# Altium schematic sheet 01_Main.SchDoc: =GlobalProjectName
size 594 x 420 mm; CheckedBy: A_D; Author: A_D; SheetNumber: 1; SheetTotal: 4; PageSetup: Record=PageOptions|CenterHorizontal=True|CenterVertical=True|PrintScale=0.70|XCorrection=1.00|YCorrection=1.00|PrintKind=2|BorderSize=5000000|LeftOffset=9000|BottomOffset=10100|Orientation=2|PaperLength=11176|PaperWidth=8636|Scale=100|PaperSource=259|PrintQuality=-3|MediaType=1|DitherType=10|PrintScaleMode=1|PaperKind=A3|PaperIndex=8
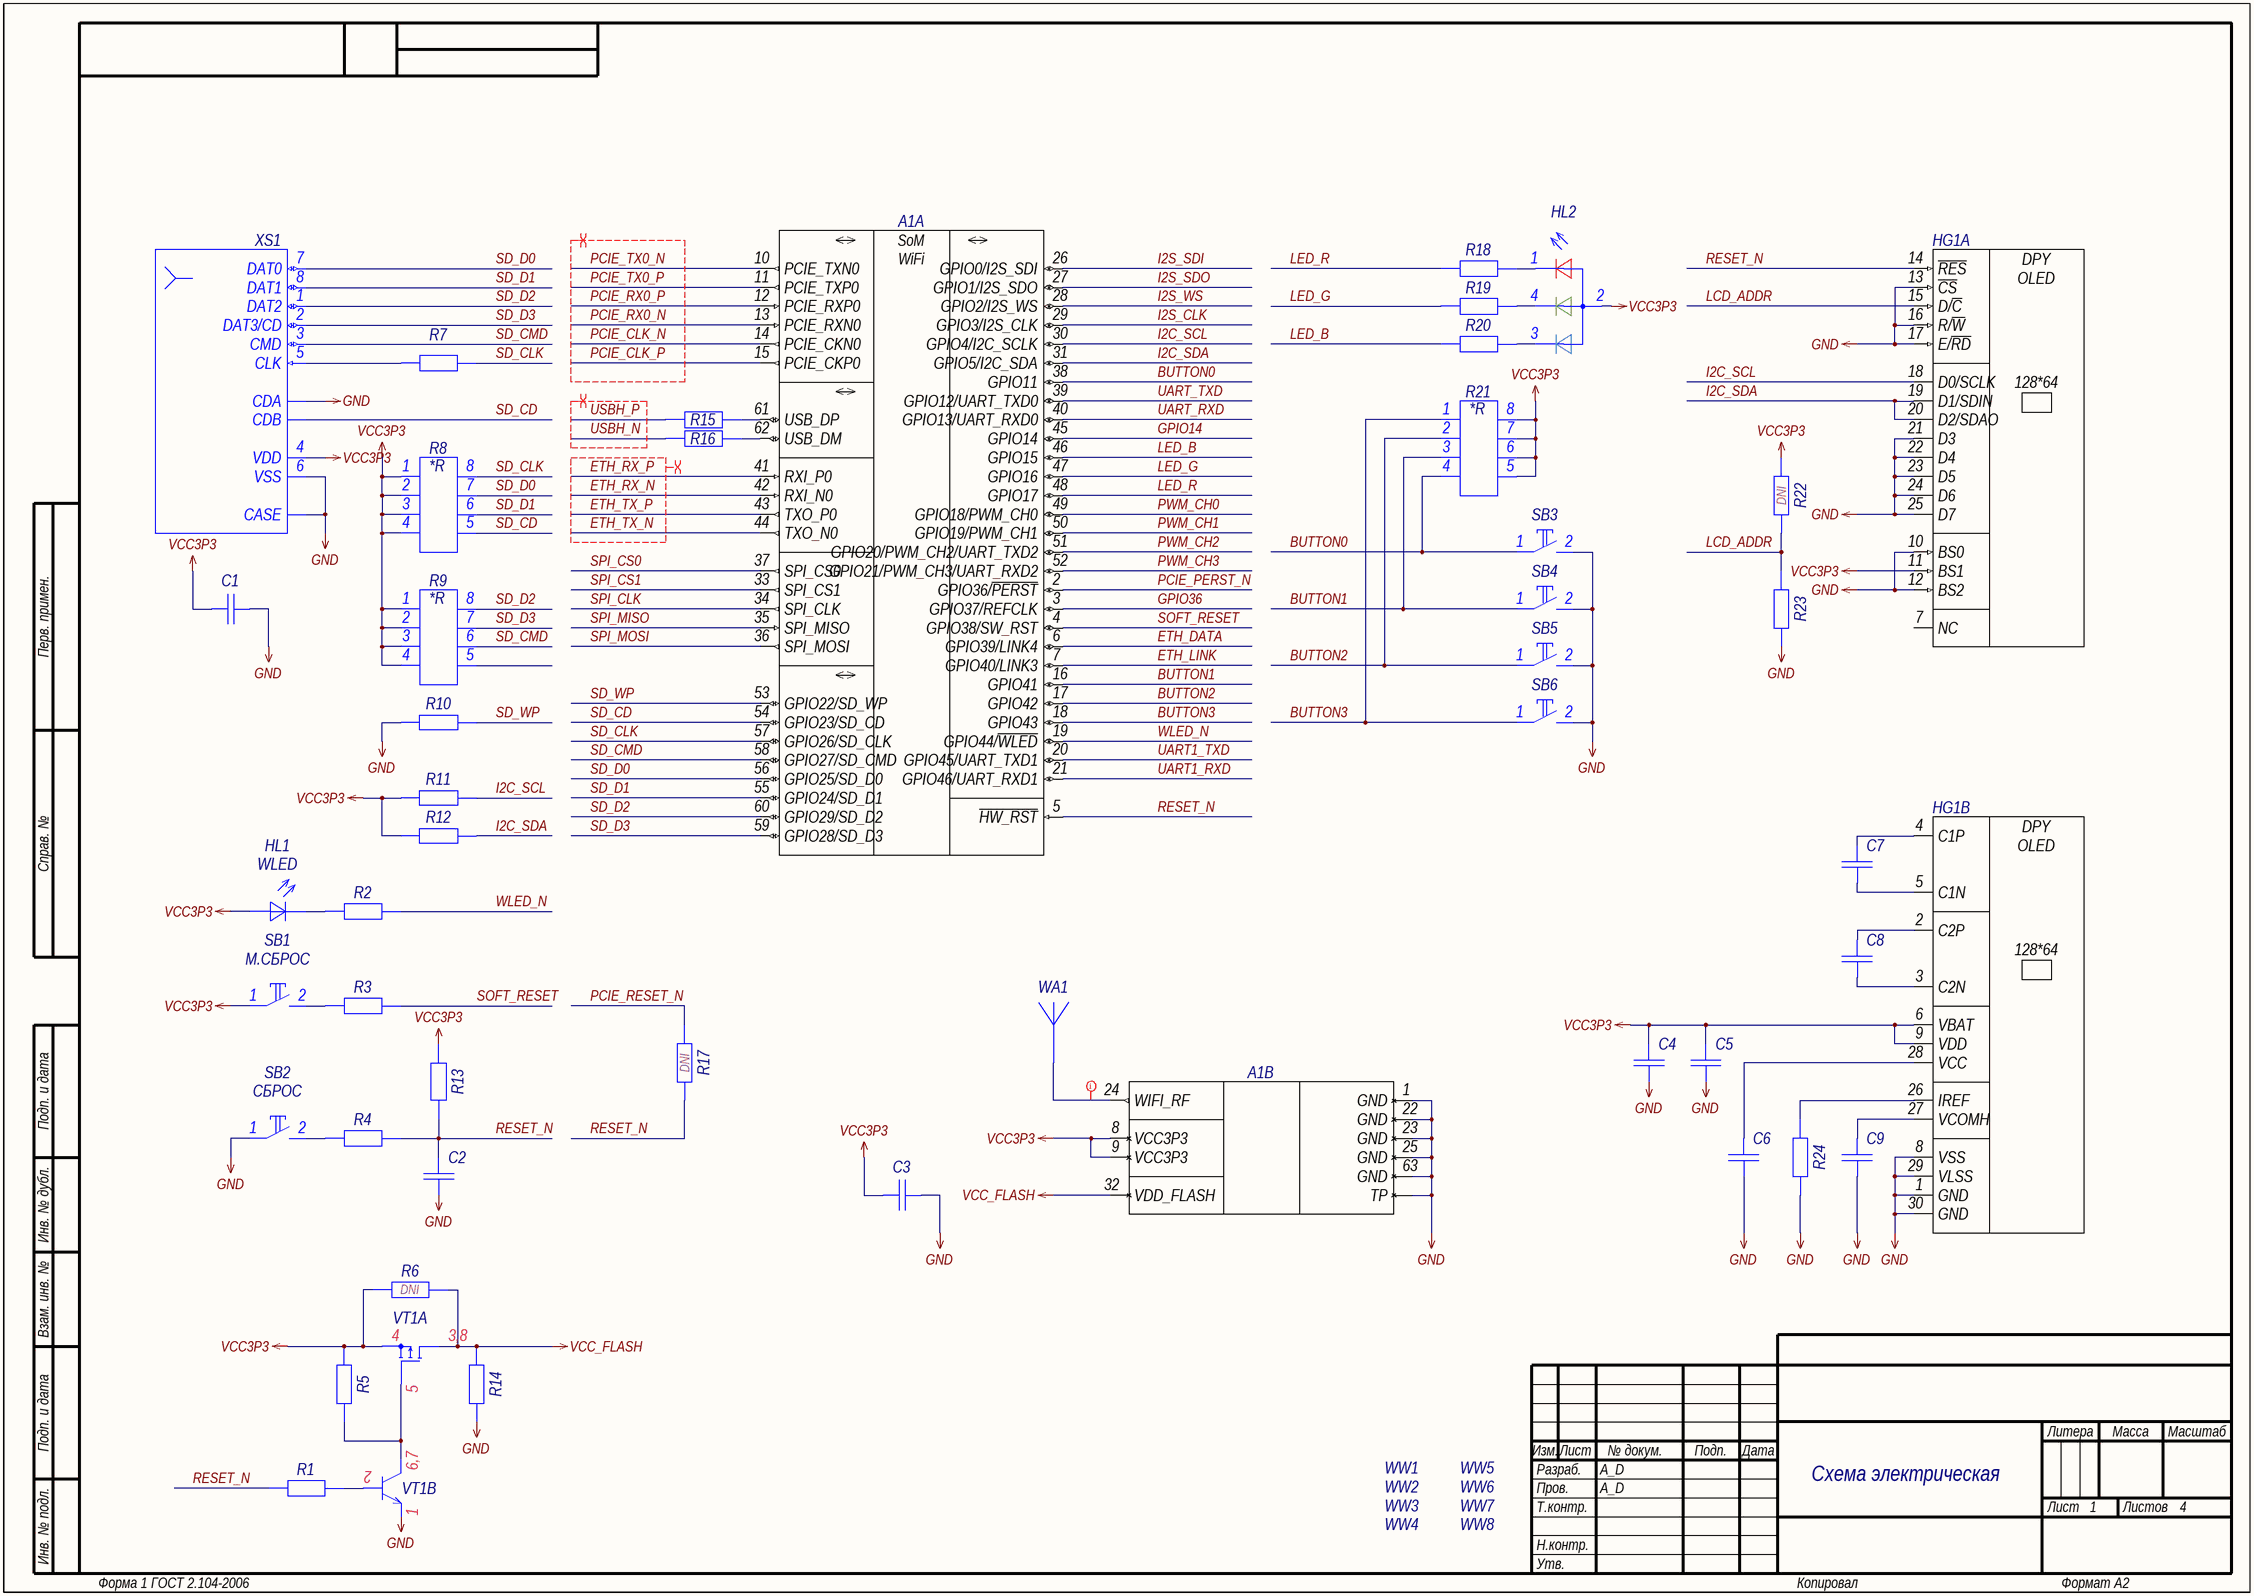
[diagram p0: 01_Main.SchDoc]

## Parts
A1  OM-O2Sx  [OM-O2Sx]  (value not drawn)  (parts A,B of 2)
C1  Capacitor  [C0603_L]  (value not drawn)
C2  Capacitor  [C0603_L]  (value not drawn)
C3  Capacitor  [C0603_L]  (value not drawn)
C4  Capacitor  [C0603_L]  (value not drawn)
C5  Capacitor  [C0603_L]  (value not drawn)
C6  Capacitor  [C0603_L]  (value not drawn)
C7  Capacitor  [C0603_L]  (value not drawn)
C8  Capacitor  [C0603_L]  (value not drawn)
C9  Capacitor  [C0603_L]  (value not drawn)
HG1  UG-2864HSWEG01  [UG-2864HSWEG01]  (value not drawn)  (parts A,B of 2)
HL1  WLED  [LD0603_L]
HL2  USER LED  [FM-B1515RGBA-HG]  (value not drawn)
R1  Resistor  [R0603_L]  (value not drawn)
R2  Resistor  [R0603_L]  (value not drawn)
R3  Resistor  [R0603_L]  (value not drawn)
R4  Resistor  [R0603_L]  (value not drawn)
R5  Resistor  [R0603_L]  (value not drawn)
R6  Resistor  [R0603_L]  (value not drawn)  (no BOM)
R7  Resistor  [R0603_L]  (value not drawn)
R8  Resistor-4  [CAT16-x4]  (value not drawn)
R9  Resistor-4  [CAT16-x4]  (value not drawn)
R10  Resistor  [R0603_L]  (value not drawn)
R11  Resistor  [R0603_L]  (value not drawn)
R12  Resistor  [R0603_L]  (value not drawn)
R13  Resistor  [R0603_L]  (value not drawn)
R14  Resistor  [R0603_L]  (value not drawn)
R15  Resistor  [R0603_L]  (value not drawn)
R16  Resistor  [R0603_L]  (value not drawn)
R17  Resistor  [R0603_L]  (value not drawn)  (no BOM)
R18  Resistor  [R0603_L]  (value not drawn)
R19  Resistor  [R0603_L]  (value not drawn)
R20  Resistor  [R0603_L]  (value not drawn)
R21  Resistor-4  [CAT16-x4]  (value not drawn)
R22  Resistor  [R0603_L]  (value not drawn)  (no BOM)
R23  Resistor  [R0603_L]  (value not drawn)
R24  Resistor  [R0603_L]  (value not drawn)
SB1  М.СБРОС  [IT-1185AP]
SB2  СБРОС  [IT-1185AP]
SB3  (no value)  [IT-1185AP]
SB4  (no value)  [IT-1185AP]
SB5  (no value)  [IT-1185AP]
SB6  (no value)  [IT-1185AP]
VT1  PMC85XP  [SOT-1118-2M_065P200X200X065_N]  (value not drawn)  (parts A,B of 2)
WA1  Antenna_US_1p  [AN9520]  (value not drawn)
WW1  NoBody  [MH_M2.5]  (value not drawn)  (no BOM)
WW2  NoBody  [MH_M2.5]  (value not drawn)  (no BOM)
WW3  NoBody  [MH_M2.5]  (value not drawn)  (no BOM)
WW4  NoBody  [MH_M2.5]  (value not drawn)  (no BOM)
WW5  NoBody  [MH_M3.0]  (value not drawn)  (no BOM)
WW6  NoBody  [MH_M3.0]  (value not drawn)  (no BOM)
WW7  NoBody  [MH_M3.0]  (value not drawn)  (no BOM)
WW8  NoBody  [MH_M3.0]  (value not drawn)  (no BOM)
XS1  DM3AT-SF-PEJM5  [DM3AT-SF-PEJM5]  (value not drawn)

## Nets
GND: A1.1(GND) A1.22(GND) A1.23(GND) A1.25(GND) A1.63(GND) A1.TP C1.2 C2.1 C3.2 C4.1 C5.1 C6.1 C9.1 HG1.1(GND) HG1.8(VSS) HG1.10(BS0) HG1.12(BS2) HG1.13(~{CS}) HG1.16(R/~{W}) HG1.17(E/~{RD}) HG1.21(D3) HG1.22(D4) HG1.23(D5) HG1.24(D6) HG1.25(D7) HG1.29(VLSS) HG1.30(GND) R10.1 R14.1 R23.1 R24.1 SB2.1 SB3.2 SB4.2 SB5.2 SB6.2 VT1.1(Э) XS1.6(VSS) XS1.CASE XS1.CDA
VCC3P3: A1.8(VCC3P3) A1.9(VCC3P3) C1.1 C3.1 C4.2 C5.2 HG1.6(VBAT) HG1.9(VDD) HG1.11(BS1) HL1.1(А) HL2.2 R5.2 R6.2 R8.1 R8.2 R8.3 R8.4 R9.1 R9.2 R9.3 R9.4 R11.1 R12.1 R13.2 R21.5 R21.6 R21.7 R21.8 R22.2 SB1.1 VT1.4(S) XS1.4(VDD)
VCC_FLASH: A1.32(VDD_FLASH) R6.1 R14.2 VT1.3(D)
BUTTON0: A1.38(GPIO11) R21.4 SB3.1
BUTTON1: A1.16(GPIO41) R21.3 SB4.1
BUTTON2: A1.17(GPIO42) R21.2 SB5.1
BUTTON3: A1.18(GPIO43) R21.1 SB6.1
ETH_DATA: A1.6(GPIO39/LINK4)
ETH_LINK: A1.7(GPIO40/LINK3)
ETH_RX_N: A1.42(RXI_N0)
ETH_RX_P: A1.41(RXI_P0)
ETH_TX_N: A1.44(TXO_N0)
ETH_TX_P: A1.43(TXO_P0)
GPIO14: A1.45(GPIO14)
GPIO36: A1.3(GPIO37/REFCLK)
I2C_SCL: A1.30(GPIO4/I2C_SCLK) HG1.18(D0/SCLK) R11.2
I2C_SDA: A1.31(GPIO5/I2C_SDA) HG1.19(D1/SDIN) HG1.20(D2/SDAO) R12.2
I2S_CLK: A1.29(GPIO3/I2S_CLK)
I2S_SDI: A1.26(GPIO0/I2S_SDI)
I2S_SDO: A1.27(GPIO1/I2S_SDO)
I2S_WS: A1.28(GPIO2/I2S_WS)
LCD_ADDR: HG1.15(D/~{C}) R22.1 R23.2
LED_B: A1.46(GPIO15) R20.1
LED_G: A1.47(GPIO16) R19.1
LED_R: A1.48(GPIO17) R18.1
PCIE_CLK_N: A1.14(PCIE_CKN0)
PCIE_CLK_P: A1.15(PCIE_CKP0)
PCIE_PERST_N: A1.2(GPIO36/~{PERST})
PCIE_RESET_N: R17.1
PCIE_RX0_N: A1.13(PCIE_RXN0)
PCIE_RX0_P: A1.12(PCIE_RXP0)
PCIE_TX0_N: A1.10(PCIE_TXN0)
PCIE_TX0_P: A1.11(PCIE_TXP0)
PWM_CH0: A1.49(GPIO18/PWM_CH0)
PWM_CH1: A1.50(GPIO19/PWM_CH1)
PWM_CH2: A1.51(GPIO20/PWM_CH2/UART_TXD2)
PWM_CH3: A1.52(GPIO21/PWM_CH3/UART_RXD2)
RESET_N: A1.5(~{HW_RST}) C2.2 HG1.14(~{RES}) R1.1 R4.2 R13.1 R17.2
SD_CD: A1.54(GPIO23/SD_CD) R8.5 XS1.CDB
SD_CLK: A1.57(GPIO26/SD_CLK) R7.2 R8.8
SD_CMD: A1.58(GPIO27/SD_CMD) R9.6 XS1.3(CMD)
SD_D0: A1.56(GPIO25/SD_D0) R8.7 XS1.7(DAT0)
SD_D1: A1.55(GPIO24/SD_D1) R8.6 XS1.8(DAT1)
SD_D2: A1.60(GPIO29/SD_D2) R9.8 XS1.1(DAT2)
SD_D3: A1.59(GPIO28/SD_D3) R9.7 XS1.2(DAT3/CD)
SD_WP: A1.53(GPIO22/SD_WP) R10.2
SOFT_RESET: A1.4(GPIO38/SW_RST) R3.2
SPI_CLK: A1.34(SPI_CLK)
SPI_CS0: A1.37(SPI_CS0)
SPI_CS1: A1.33(SPI_CS1)
SPI_MISO: A1.35(SPI_MISO)
SPI_MOSI: A1.36(SPI_MOSI)
UART1_RXD: A1.21(GPIO46/UART_RXD1)
UART1_TXD: A1.20(GPIO45/UART_TXD1)
UART_RXD: A1.40(GPIO13/UART_RXD0)
UART_TXD: A1.39(GPIO12/UART_TXD0)
USBH_N: R16.1
USBH_P: R15.1
WLED_N: A1.19(GPIO44/~{WLED}) R2.2
NetA1_24: A1.24(WIFI_RF) WA1.1
NetA1_61: A1.61(USB_DP) R15.2
NetA1_62: A1.62(USB_DM) R16.2
NetC6_2: C6.2 HG1.28(VCC)
NetC7_1: C7.1 HG1.5(C1N)
NetC7_2: C7.2 HG1.4(C1P)
NetC8_1: C8.1 HG1.3(C2N)
NetC8_2: C8.2 HG1.2(C2P)
NetC9_2: C9.2 HG1.27(VCOMH)
NetHG1_26: HG1.26(IREF) R24.2
NetHL1_2: HL1.2(К) R2.1
NetHL2_1: HL2.1 R18.2
NetHL2_3: HL2.3 R20.2
NetHL2_4: HL2.4 R19.2
NetR1_2: R1.2 VT1.2(Б)
NetR3_1: R3.1 SB1.2
NetR4_1: R4.1 SB2.2
NetR5_1: R5.1 VT1.5(G) VT1.6(К)
NetR7_1: R7.1 XS1.5(CLK)

Not connected (* = marked no-connect by the designer): HG1 7(NC); R9 5

## Layout directives
net class RF; rule Clearance Constraint [Clearance = 0.3mm]: NetA1_24
differential pair; differential pair class PCIE_DiffPair; rule Matched Net Lengths [Tolerance = 1mm]: PCIE_CLK_N, PCIE_CLK_P, PCIE_RX0_N, PCIE_RX0_P, PCIE_TX0_N, PCIE_TX0_P
differential pair; differential pair class USB_DiffPair; rule Matched Net Lengths [Tolerance = 1mm]: USBH_N, USBH_P
differential pair; differential pair class ETH_DiffPair; rule Matched Net Lengths [Tolerance = 1mm]: ETH_RX_N, ETH_RX_P, ETH_TX_N, ETH_TX_P

## Notes on the sheet
- (near R22) DNI
- (near R17) DNI
- (near R6) DNI
- Схема электрическая
  принципиальная
- Перв. примен.
- Справ. №
- Подп. и дата
- Инв. № дубл.
- Взам. инв. №
- Разраб.
- Изм.
- Лист
- № докум.
- Подп.
- Дата
- Литера
- Масса
- Масштаб
- Пров.
- Т.контр.
- Листов
- Инв. № подл.
- Н.контр.
- Утв.
- Форма 1 ГОСТ 2.104-2006
- Копировал
- Формат А2
- (in symbol CAT16-103J4LF) *R
- (in symbol OM-O2SP, part A) SoM; WiFi
- (in symbol PMC85XP, part A) 3,8
- (in symbol PMC85XP, part B) 6,7
- (in symbol UG-2864HSWEG01, part A) DPY
- (in symbol UG-2864HSWEG01, part B) DPY

## Library data of the parts
A1 = OM-O2SP: Manufacturer: Onion; ID: 1; Supply Operation: +2.97...3.63V; Supply Current: 400mA; ROM/RAM: 32MB/128MB; Wireless Compatibility: Wi-Fi; Supported Interfaces: GPIO, I2C, I2S, SPI, UART, USB; I/O Lines: 42; Operation Frequency: 580MHz; Working Temperature Min: -10°С; Working Temperature Max: +55°С; Functional Analog: OM-O2S; Published: 06.03.2019; Publisher: Andrew Danich; Type: Модуль; Part Number: OM-O2SP; Value: OM-O2SP; Application Category: 1
C1 C3 = GRM188R61A106KE69D: Manufacturer: Murata; Type: Конденсатор; ID: 173; Value: 10uF; Voltage: 10V; Tolerance: ±10%; Dielectric Type: X5R; Application Category: 1; Working Temperature Min: -55°С; Working Temperature Max: +85°С; Published: 18.05.2010; Publisher: Andrew Danich; Part Number: GRM188R61A106KE69D; Footprint: 0603
C2 = GRM188R72A104KA35D: Manufacturer: Murata; Type: Конденсатор; ID: 232; Value: 0.1uF; Voltage: 100V; Tolerance: ±10%; Dielectric Type: X7R; Application Category: 1; Working Temperature Min: -55°С; Working Temperature Max: +125°С; Published: 18.05.2010; Publisher: Andrew Danich; Part Number: GRM188R72A104KA35D; Footprint: 0603
C4 C5 C7 C8 = GCM188R71E105KA64D: Manufacturer: Murata; Type: Конденсатор; ID: 134; Value: 1uF; Voltage: 25V; Tolerance: ±10%; Dielectric Type: X7R; Application Category: 1; Working Temperature Min: -55°С; Working Temperature Max: +85°С; Published: 18.05.2010; Publisher: Andrew Danich; Part Number: GCM188R71E105KA64D; Footprint: 0603
C6 = GRM188R61E225MA12D: Manufacturer: Murata; Type: Конденсатор; ID: 152; Value: 2.2uF; Voltage: 25V; Tolerance: ±20%; Dielectric Type: X5R; Application Category: 1; Working Temperature Min: -55°С; Working Temperature Max: +85°С; Published: 18.05.2010; Publisher: Andrew Danich; Part Number: GRM188R61E225MA12D; Footprint: 0603
C9 = GRT188C81E475KE13D: Manufacturer: Murata; Type: Конденсатор; ID: 175; Value: 4.7uF; Voltage: 25V; Tolerance: ±20%; Dielectric Type: X6S; Application Category: 1; Working Temperature Min: -55°С; Working Temperature Max: +105°С; Published: 18.05.2010; Publisher: Andrew Danich; Part Number: GRT188C81E475KE13D; Footprint: 0603
HG1 = UG-2864HSWEG01: Manufacturer: WiseChip Semiconductor; ID: 1; Supply Operation: +1.65…3.3V; Supply Current: 28.9mA; Resolution - Pixels: 128*64; Diagonal: 0.96; Touch Panel: No; Display Type: OLED; Working Temperature Min: -30°С; Working Temperature Max: +70°С; Published: 13.03.2019; Publisher: Andrew Danich; Type: Индикатор графический; Part Number: UG-2864HSWEG01; Value: UG-2864HSWEG01; Application Category: 1
HL1 = BL-LS0603DNB: Type: Индикатор единичный; ID: 12; Forward Voltage: 3.5V; Forward Current: 30mA; Power Dissipation: 78mW; Color: Blue; Leds: 1; Published: 03.12.2013; Publisher: Andrew Danich; Part Number: BL-LS0603DNB; Value: BL-LS0603DNB; Footprint: 0603; Application Category: 1
HL2 = FM-B1515RGBA-HG: Manufacturer: Foshan NationStar Optoelectronics; Type: Сборка индикаторная; ID: 36; Forward Voltage: 2.4/3.4/3.4V; Forward Current: 50/40/40mA; Power Dissipation: 48/68/68mW; Color: Red, Green, Blue; Leds: 3; Application Category: 1; Working Temperature Min: -30°С; Working Temperature Max: +85°С; Published: 17.03.2019; Publisher: Andrew Danich; Part Number: FM-B1515RGBA-HG; Value: FM-B1515RGBA-HG
R1 = RC0603JR-0722KL: Manufacturer: Yageo; ID: 32; Value: 22k; Limit Voltage: 50V; Tolerance: ±5%; Temperature Coefficient: 100ppm; Total Power Dissipation: 0.1W; Series Type: Thick-Film; Application Category: 1; Working Temperature Min: -55°С; Working Temperature Max: +155°С; Published: 24.03.2010; Publisher: Andrew Danich; Type: Резистор; Part Number: RC0603JR-0722KL; Footprint: 0603
R2 = RC0603JR-071KL: Manufacturer: Yageo; ID: 19; Value: 1k; Limit Voltage: 50V; Tolerance: ±5%; Temperature Coefficient: 100ppm; Total Power Dissipation: 0.1W; Series Type: Thick-Film; Application Category: 1; Working Temperature Min: -55°С; Working Temperature Max: +155°С; Functional Analog: CR0603-JW-102E; Published: 24.03.2010; Publisher: Andrew Danich; Type: Резистор; Part Number: RC0603JR-071KL; Footprint: 0603
R3 R14 = RC0603JR-073KL: Manufacturer: Yageo; ID: 52; Value: 3k; Limit Voltage: 50V; Tolerance: ±5%; Temperature Coefficient: 100ppm; Total Power Dissipation: 0.1W; Series Type: Thick-Film; Application Category: 1; Working Temperature Min: -55°С; Working Temperature Max: +155°С; Published: 24.03.2010; Publisher: Andrew Danich; Type: Резистор; Part Number: RC0603JR-073KL; Footprint: 0603
R4 R18-R20 = RC0603JR-07100R: Manufacturer: Yageo; ID: 10; Value: 100; Limit Voltage: 50V; Tolerance: ±5%; Temperature Coefficient: 100ppm; Total Power Dissipation: 0.1W; Series Type: Thick-Film; Application Category: 1; Working Temperature Min: -55°С; Working Temperature Max: +155°С; Functional Analog: CR0603-JW-101E; Published: 24.03.2010; Publisher: Andrew Danich; Type: Резистор; Part Number: RC0603JR-07100R; Footprint: 0603
R5 = RC0603JR-0710KL: Manufacturer: Yageo; ID: 12; Value: 10k; Limit Voltage: 50V; Tolerance: ±5%; Temperature Coefficient: 100ppm; Total Power Dissipation: 0.1W; Series Type: Thick-Film; Application Category: 1; Working Temperature Min: -55°С; Working Temperature Max: +155°С; Functional Analog: CR0603-JW-103E; Published: 24.03.2010; Publisher: Andrew Danich; Type: Резистор; Part Number: RC0603JR-0710KL; Footprint: 0603
R6 R17 R22 R23 = RC0603JR-070R: Manufacturer: Yageo; ID: 5; Value: 0; Limit Voltage: 50V; Tolerance: ±5%; Temperature Coefficient: 100ppm; Total Power Dissipation: 0.1W; Series Type: Thick-Film; Application Category: 1; Working Temperature Min: -55°С; Working Temperature Max: +155°С; Functional Analog: RC0603FR-070RL, CR0603-J/-000E; Published: 24.03.2010; Publisher: Andrew Danich; Type: Резистор; Part Number: RC0603JR-070R; Footprint: 0603
R7 = RC0603JR-0730RL: Manufacturer: Yageo; ID: 412; Value: 30; Limit Voltage: 50V; Tolerance: ±5%; Temperature Coefficient: 100ppm; Total Power Dissipation: 0.1W; Series Type: Thick-Film; Application Category: 1; Working Temperature Min: -55°С; Working Temperature Max: +155°С; Published: 24.03.2010; Publisher: Andrew Danich; Type: Резистор; Part Number: RC0603JR-0730RL; Footprint: 0603
R8 R9 R21 = CAT16-103J4LF: Manufacturer: Bourns; ID: 232; Value: 10k; Limit Voltage: 50V; Tolerance: ±5%; Temperature Coefficient: 200ppm; Total Power Dissipation: 0,062W; Series Type: Thick-Film; Application Category: 1; Working Temperature Min: -55°С; Working Temperature Max: +125°С; Functional Analog: TC164-JR-0710KL; Published: 15.07.2014; Publisher: Andrew Danich; Type: Набор резисторов; Part Number: CAT16-103J4LF
R10-R13 = RC0603JR-074K7L: Manufacturer: Yageo; ID: 56; Value: 4.7k; Limit Voltage: 50V; Tolerance: ±5%; Temperature Coefficient: 100ppm; Total Power Dissipation: 0.1W; Series Type: Thick-Film; Application Category: 1; Working Temperature Min: -55°С; Working Temperature Max: +155°С; Published: 24.03.2010; Publisher: Andrew Danich; Type: Резистор; Part Number: RC0603JR-074K7L; Footprint: 0603
R15 R16 = RC0603JR-0722RL: Manufacturer: Yageo; ID: 29; Value: 22; Limit Voltage: 50V; Tolerance: ±5%; Temperature Coefficient: 100ppm; Total Power Dissipation: 0.1W; Series Type: Thick-Film; Application Category: 1; Working Temperature Min: -55°С; Working Temperature Max: +155°С; Published: 24.03.2010; Publisher: Andrew Danich; Type: Резистор; Part Number: RC0603JR-0722RL; Footprint: 0603
R24 = RC0603JR-07910KL: Manufacturer: Yageo; ID: 88; Value: 910k; Limit Voltage: 50V; Tolerance: ±5%; Temperature Coefficient: 100ppm; Total Power Dissipation: 0.1W; Series Type: Thick-Film; Application Category: 1; Working Temperature Min: -55°С; Working Temperature Max: +155°С; Published: 24.03.2010; Publisher: Andrew Danich; Type: Резистор; Part Number: RC0603JR-07910KL; Footprint: 0603
SB1-SB6 = IT-1185AP: ID: 36; Limit Current: 50mA; Resistance: 0.1ohm; Isolator Resistance: 100meg; Backlight: NO; Number of Contacts: 2; Application Category: 1; Published: 17.04.2014; Publisher: Andrew Danich; Type: Переключатель; Part Number: IT-1185AP; Value: IT-1185AP; Height: 5mm
VT1 = PMC85XP: Manufacturer: NXP Semiconductors; Type: Сборка транзисторная; ID: 33; D-S Voltage: -30V; Drain Current: -3.4A; D-S On-Resistance: 110momh; Gate Capacitance: 680pF; Total Power Dissipation: 1.17W; Gate Threshold Voltage: -1.2V; Application Category: 1; Working Temperature Min: -55°С; Working Temperature Max: +150°С; Published: 13.03.2017; Publisher: Andrew Danich; Part Number: PMC85XP; Value: PMC85XP; Functional Analog: -
WA1 = AN9520: Manufacturer: RainSun; ID: 1; Value: AN9520; Center Frequency: 2.45GHz; Peak Gain: 1.5dBi; VSWR: 2.0; Input Impedance: 50ohm; Power Handling: 3W; Azimuth Beamwidth: Omni‐directional; Bandwidth: Linear; Working Temperature Min: -40°С; Working Temperature Max: +85°С; Published: 15.01.2015; Type: Антенна; Publisher: Andrew Danich; Part Number: AN9520; Application Category: 1
WW1-WW8 = MOUNTINGHOLE: ID: 1; Published: 24.03.2015; Publisher: Andrew Danich; Type: Лепесток; Part Number: MOUNTINGHOLE; Value: MOUNTINGHOLE
XS1 = DM3AT-SF-PEJM5: Manufacturer: Hirose Connector; ID: 5; Limit Voltage: 125V; Style: Push-Push; Connector Type: microSD Card; Interface: SPI\SDIO; Pitch: 1.1mm; Application Category: 1; Working Temperature Min: -25°С; Working Temperature Max: +85°С; Value: DM3AT-SF-PEJM5; Published: 14.03.2019; Publisher: Andrew Danich; Type: Розетка; Part Number: DM3AT-SF-PEJM5; Pins: 10